# EAGLE design BlinkingLightsW555 (EAGLE 8.6.0)
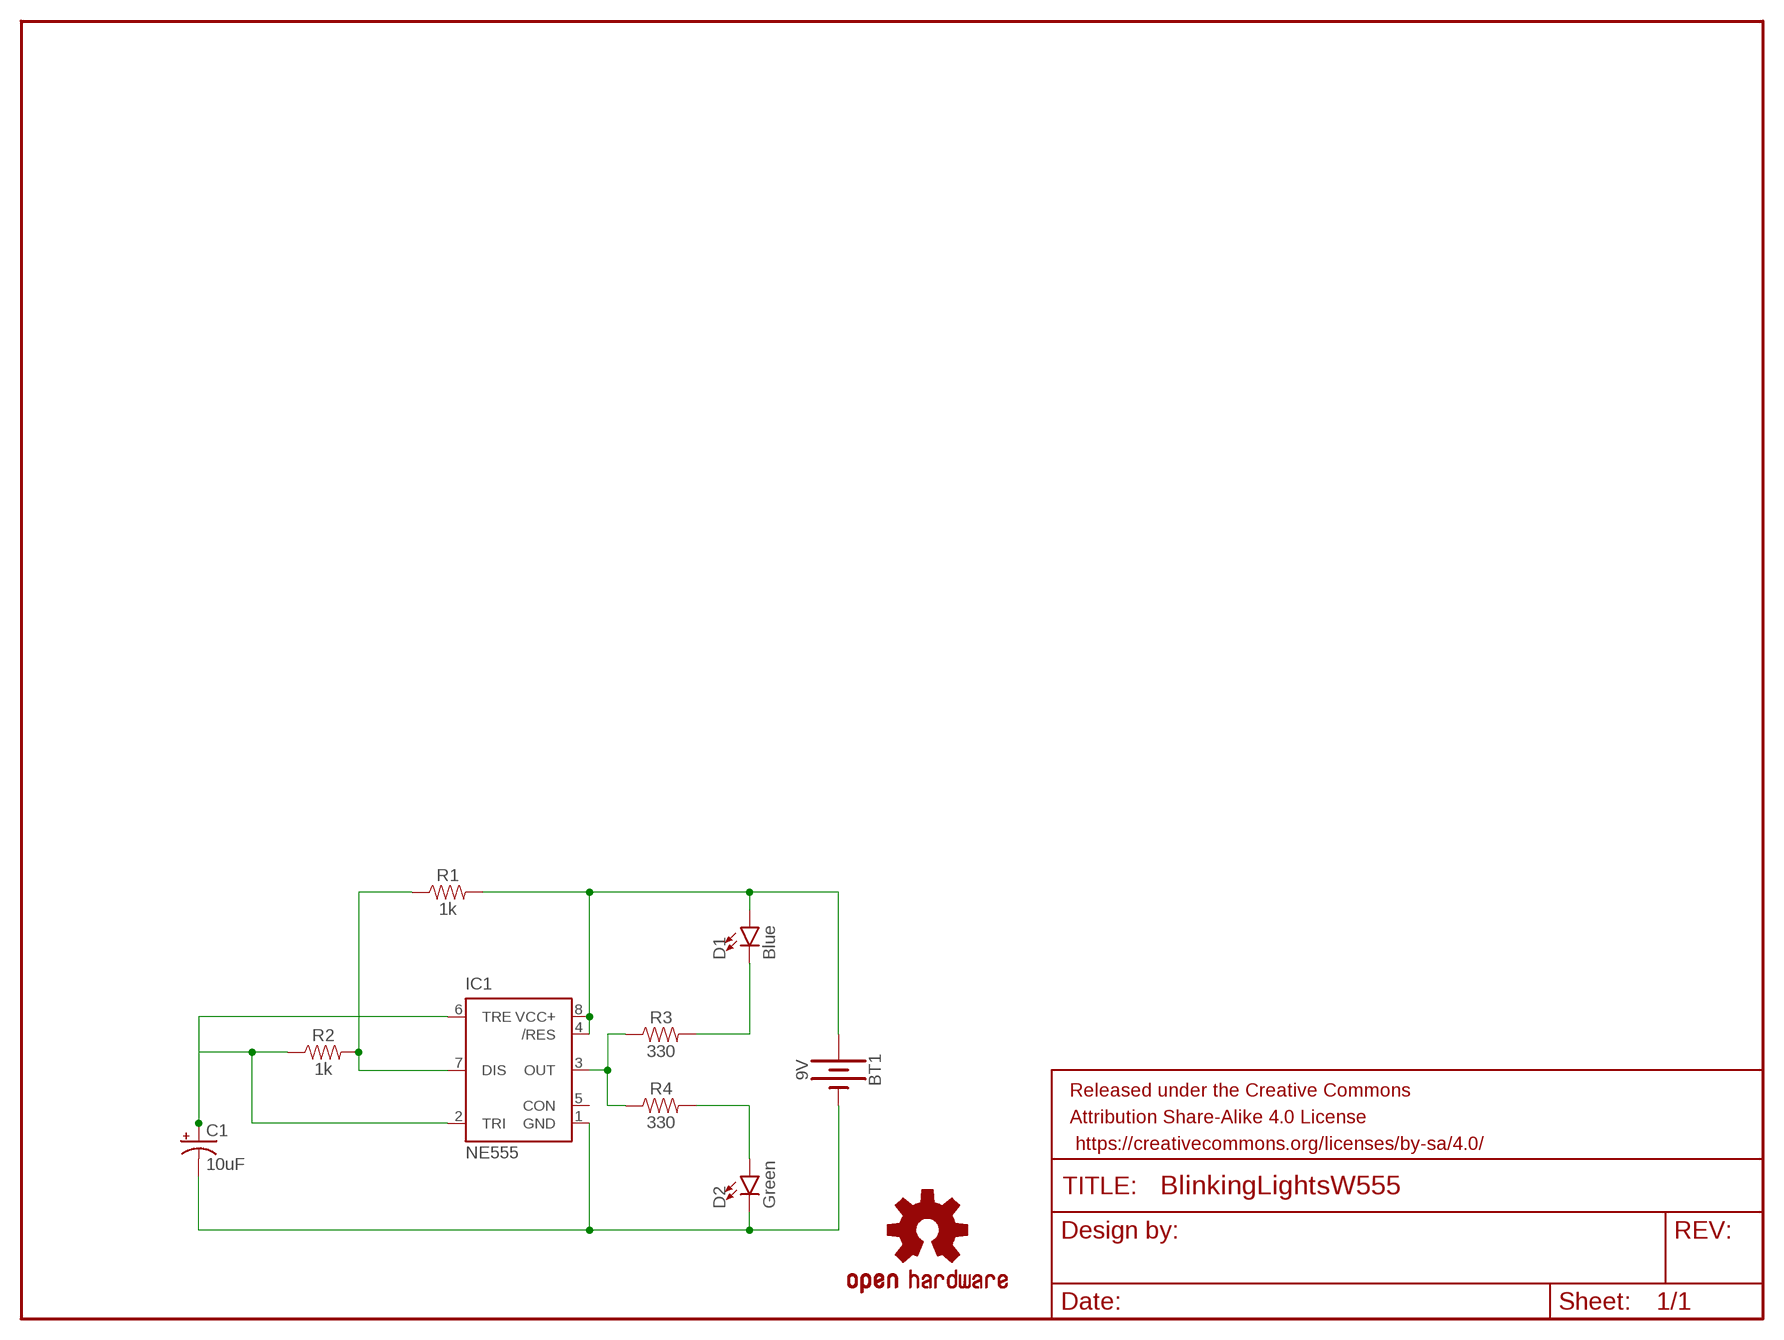
[diagram p0: schematic, sheet 1]

## Parts
BT1  9V  BATTERY-9V  [BATTCON_9V]
C1  10uF  10UF-POLAR-RADIAL-2.5MM-KIT-25V-20%  [CPOL-RADIAL-2.5MM-5MM-KIT]
D1  Blue  LED10MM  [LED_10MM]
D2  Green  LED10MM  [LED_10MM]
FRAME1  FRAME-LETTERNO_PACKAGE  [DUMMY]
IC1  NE555  [DIL-08]
LOGO2  OSHW-LOGOM  [OSHW-LOGO-M]
R1  1k  1KOHM-HORIZ-1/4W-1%  [AXIAL-0.3]
R2  1k  1KOHM-HORIZ-1/4W-1%  [AXIAL-0.3]
R3  330  330OHM-HORIZ-1/10W-5%  [AXIAL-0.3]
R4  330  330OHM-HORIZ-1/10W-5%  [AXIAL-0.3]

## Nets
N$2: D1.C R3.P$2
N$3: IC1.3(OUT) R3.P$1 R4.P$1
N$4: BT1.+ D1.A IC1.4(/RES) IC1.8(VCC+) R1.P$2
N$5: D2.A R4.P$2
N$6: BT1.- C1.2(-) D2.C IC1.1(GND)
N$7: IC1.7(DIS) R1.P$1 R2.P$2
N$8: C1.1(+) IC1.2(TRI) IC1.6(TRE) R2.P$1
Unconnected: IC1.5(CON)

## Library data of the parts
BT1 = SparkFun-Batteries:BATTERY: Battery - Single Cell A variety of battery chemistries, sizes, and footprints. Device List: 20MM_PTH - Coin Cell Battery Holder - 20mm (PTH) <https://www.sparkfun.com/products/783> 6.8MM_PTH - Coin Cell Battery Holder - 6.8MM(SMD) <https://www.digikey.com/product-detail/en/seiko-instruments/MS621FE-FL11E/728-1057-ND/1889208?WT.srch=1&gclid=CNOQ5a6LzdQCFZS2wAodXCkE0g> 12MM_SMD - Coin Cell Battery Holder - 12mm (SMD) <https://www.sparkfun.com/products/10592> 12MM_PTH - Coin Cell Battery Holder - 12mm (PTH) <https://www.sparkfun.com/products/7948> 20MM_SMD - 20mm Coin Cell Battery Holder (SMD) (2 legs) Used on the Big Time Watch Kit <https://www.sparkfun.com/products/11734> 20MM_SMD_4LEGS - Coin Cell Battery Holder - 20mm (SMD) <https://www.sparkfun.com/products/11892> 20MM_SMD_4LEGS_OVERPASTE - Coin Cell Battery Holder - 20mm (SMD) <https://www.sparkfun.com/products/11892> (Over-paste on the legs) 24.5MM_PTH - Coin Cell Battery Holder - 24.5mm (PTH) <https://www.sparkfun.com/products/8863> 9V - 9V Battery Holder - PC Mount Used on the SparkFun SparkPunk Sound Kit <https://www.sparkfun.com/products/11177> and SparkFun SparkPunk Sequencer Kit <https://www.sparkfun.com/products/12707> 18650 - Battery Holder - 18650 (PTH) <https://www.sparkfun.com/products/13113> AA - Battery Holder - 1xAA (PTH) <https://www.sparkfun.com/products/7949> AAA - Battery Holder - 1xAAA (PTH) <https://www.sparkfun.com/products/12718> AA_KIT - Battery Holder - 1xAA (PTH) <https://www.sparkfun.com/products/7949> Special kit package - pads only have exposed copper on one side of the board. AAA_KIT - Battery Holder - 1xAAA (PTH) <https://www.sparkfun.com/products/12718> Special kit package - pads only have exposed copper on one side of the board.; PROD_ID: BATT-10855
C1 = SparkFun-Capacitors:10UF-POLAR: 10.0µF polarized capacitors A capacitor is a passive two-terminal electrical component used to store electrical energy temporarily in an electric field.; PROD_ID: CAP-08440
D1 D2 = SparkFun-LED:LED: LED (Generic) Standard schematic elements and footprints for 5mm, 3mm, 1206, and 0603 sized LEDs. Generic LEDs with no color specified.
FRAME1 = SparkFun-Aesthetics:FRAME-LETTER: Schematic Frame - Letter Standard 8.5x11 US Letter frame; DESIGNER: Nobody; VERSION: v01
IC1 = st-microelectronics:NE555: General purpose bipolar Timer; MF: Arrow Electronics; MPN: NE555N; OC_FARNELL: 1467742; OC_NEWARK: 89K1486
LOGO2 = SparkFun-Aesthetics:OSHW-LOGO: Open-Source Hardware (OSHW) Logo This logo indicates the piece of hardware it is found on incorporates a OSHW license and/or adheres to the definition of open source hardware found here: http://freedomdefined.org/OSHW
R1 R2 = SparkFun-Resistors:1KOHM: 1kΩ resistor A resistor is a passive two-terminal electrical component that implements electrical resistance as a circuit element. Resistors act to reduce current flow, and, at the same time, act to lower voltage levels within circuits. - Wikipedia; PROD_ID: RES-12182
R3 R4 = SparkFun-Resistors:330OHM: 330Ω resistor A resistor is a passive two-terminal electrical component that implements electrical resistance as a circuit element. Resistors act to reduce current flow, and, at the same time, act to lower voltage levels within circuits. - Wikipedia; PROD_ID: RES-8371

## Board
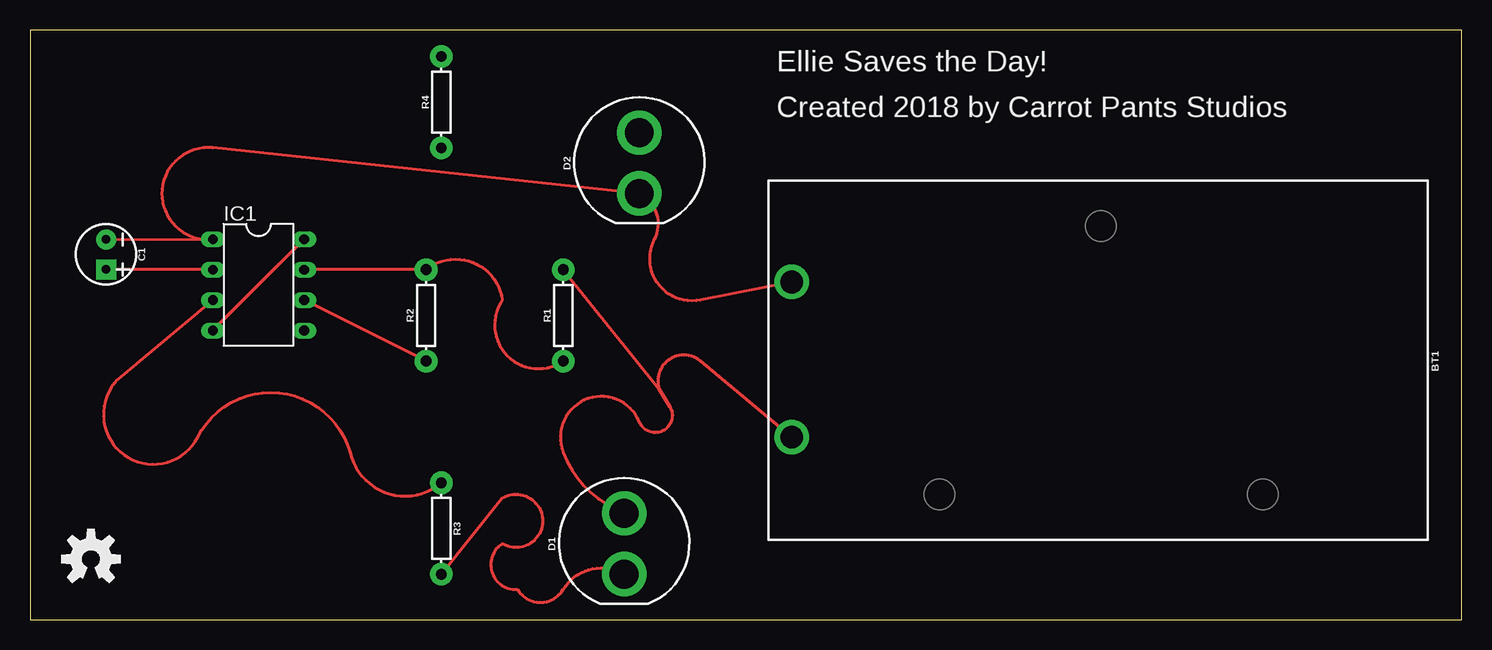
[diagram p1: board, top side]
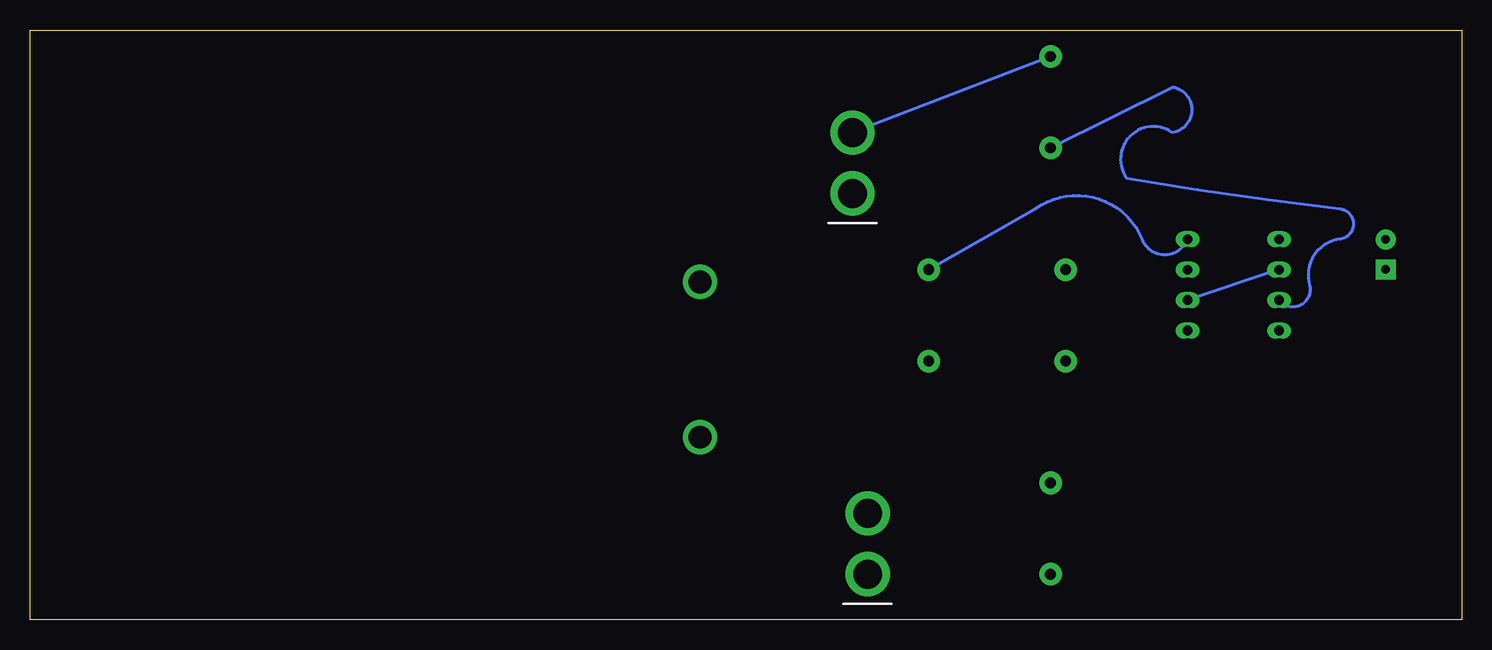
[diagram p2: board, bottom side, seen from below]

Size 119.36 x 49.2 mm. Coordinates in mm from the lower left corner, seen from the top.
Outline: 0,0 119.36,0 119.36,49.2 0,49.2 0,0
Copper layers (1*16): Top 0.035mm / dielectric 1.5mm / Bottom 0.035mm
Design rules "OthermillDRC_1_100_v2": minimum track width 8mil, minimum drill 0.8mm, track to track 0.256540625mm, track to pad 0.256540625mm, pad to pad 0.256540625mm, via to via 0.256540625mm, smd to smd 0mil, copper to edge 0mil, drill to drill 1mil, minimum pad ring 10mil, minimum via ring 10mil, stop-mask expansion 1mil, vias tented up to drill 30mil, thermal gap 10mil

### Footprints (pad centres in the part's own frame; a part is rotated, then mirrored left to right if it is on the bottom)
BATTCON_9V = drill 1.905: + 0,0; - 0,-12.954
CPOL-RADIAL-2.5MM-5MM-KIT = drill 0.7 pad 1.651 square: 1 1.25,0 | drill 0.7 pad 1.651: 2 -1.25,0
LED_10MM = drill 2.4 pad 3.7: A 2.54,0; C -2.54,0
DIL-08 = drill 0.813 long: 1 -3.81,-3.81; 2 -1.27,-3.81; 3 1.27,-3.81; 4 3.81,-3.81; 5 3.81,3.81; 6 1.27,3.81; 7 -1.27,3.81; 8 -3.81,3.81
AXIAL-0.3 = drill 0.9 pad 1.88: P$1 -3.81,0; P$2 3.81,0

### Placement (x,y rotation side)
BT1  63.5,15.24 180 top
C1  6.35,30.48 270 top
D1  49.53,6.35 90 top
D2  50.8,38.1 90 top
FRAME1  0,0 0 top
IC1  19.05,27.94 270 top
LOGO2  5.08,5.08 0 top
R1  44.45,25.4 90 top
R2  33.02,25.4 90 top
R3  34.29,7.62 270 top
R4  34.29,43.18 90 top

### Tracks (layer width: path | path; a pad name or v marks a point on that pad's centre or on a via)
N$2
  Top 0.254: R3.P$2 39.37,10.16 arc-242 39.37,6.35 arc152 40.64,2.54 arc118 44.45,2.54 arc-90 D1.C
N$3
  Top 0.254: IC1.3 7.62,20.32 arc203 13.97,15.24 arc-137 26.67,13.97 arc117 R3.P$1
  Bottom 0.254: R4.P$1 24.13,44.45 arc161 24.13,40.64 arc-161 27.94,36.83 arc-3 10.16,34.29 arc166 10.16,31.75 arc-99 12.7,27.94 arc159 IC1.3
N$4
  Top 0.254: R1.P$2 52.44,19.27 arc-148 55.88,21.59 | 53.34,17.78 arc-189 50.8,16.51 arc179 44.45,13.97 arc47 D1.A
  Top 0.305: IC1.8 IC1.4 | 52.44,19.27 53.34,17.78 | BT1.+ 55.88,21.59
  Bottom 0.254: R1.P$2 35.56,34.29 arc104 26.67,31.75 arc-136 IC1.8
N$5
  Bottom 0.254: R4.P$2 D2.A
N$6
  Top 0.254: BT1.- 55.88,26.67 arc-129 52.07,31.75 arc92 D2.C 15.24,39.37 arc192 IC1.1 C1.2
N$7
  Top 0.254: IC1.7 R2.P$2 arc-122 39.37,26.67 arc159 R1.P$1
N$8
  Top 0.254: IC1.2 C1.1 | R2.P$1 IC1.6
  Bottom 0.254: IC1.2 IC1.6

### Text on the board
tPlace: Ellie Saves the Day! | Created 2018 by Carrot Pants Studios